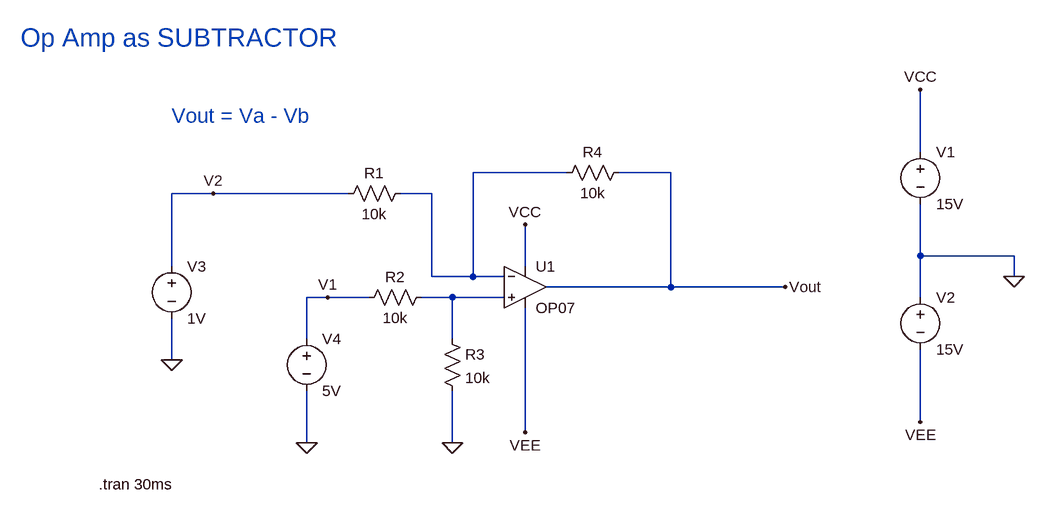
[diagram p0: schematic Op_Amp_Subtractor.asc]
Op_Amp_Subtractor.asc, the LTspice schematic file:
Version 4
SHEET 1 1220 680
WIRE 1056 -48 1056 -144
WIRE 512 -16 368 -16
WIRE 672 -16 592 -16
WIRE -32 16 -96 16
WIRE 176 16 -32 16
WIRE 304 16 256 16
WIRE 1056 112 1056 32
WIRE 1200 112 1056 112
WIRE -96 128 -96 16
WIRE 448 128 448 64
WIRE 304 144 304 16
WIRE 368 144 368 -16
WIRE 368 144 304 144
WIRE 416 144 368 144
WIRE 1200 144 1200 112
WIRE 672 160 672 -16
WIRE 672 160 480 160
WIRE 848 160 672 160
WIRE 144 176 112 176
WIRE 208 176 144 176
WIRE 336 176 288 176
WIRE 416 176 336 176
WIRE 1056 176 1056 112
WIRE 112 240 112 176
WIRE 336 240 336 176
WIRE -96 272 -96 208
WIRE 1056 368 1056 256
WIRE 448 384 448 192
WIRE 112 400 112 320
WIRE 336 400 336 320
FLAG 848 160 Vout
FLAG 112 400 0
FLAG -96 272 0
FLAG 1200 144 0
FLAG 1056 368 VEE
FLAG 1056 -144 VCC
FLAG 448 384 VEE
FLAG 448 64 VCC
FLAG -32 16 V2
FLAG 144 176 V1
FLAG 336 400 0
SYMBOL OpAmps\\OP07 448 96 R0
SYMATTR InstName U1
SYMBOL res 608 -32 R90
WINDOW 0 0 56 VBottom 2
WINDOW 3 32 56 VTop 2
SYMATTR InstName R4
SYMATTR Value 10k
SYMBOL res 272 0 R90
WINDOW 0 0 56 VBottom 2
WINDOW 3 32 56 VTop 2
SYMATTR InstName R1
SYMATTR Value 10k
SYMBOL res 304 160 R90
WINDOW 0 0 56 VBottom 2
WINDOW 3 32 56 VTop 2
SYMATTR InstName R2
SYMATTR Value 10k
SYMBOL voltage 112 224 R0
WINDOW 123 0 0 Left 0
WINDOW 39 0 0 Left 0
SYMATTR InstName V4
SYMATTR Value 5V
SYMBOL voltage 1056 -64 R0
WINDOW 123 0 0 Left 0
WINDOW 39 0 0 Left 0
SYMATTR InstName V1
SYMATTR Value 15V
SYMBOL voltage 1056 160 R0
WINDOW 123 0 0 Left 0
WINDOW 39 0 0 Left 0
SYMATTR InstName V2
SYMATTR Value 15V
SYMBOL res 320 224 R0
SYMATTR InstName R3
SYMATTR Value 10k
SYMBOL voltage -96 112 R0
WINDOW 123 0 0 Left 0
WINDOW 39 0 0 Left 0
SYMATTR InstName V3
SYMATTR Value 1V
TEXT -328 -224 Left 4 ;Op Amp as SUBTRACTOR
TEXT -208 464 Left 2 !.tran 30ms
TEXT -96 -104 Left 3 ;Vout = Va - Vb

The netlist it stands for:
* Op_Amp_Subtractor.asc
XU1 N002 N001 VCC VEE Vout LT1001  ; OP07, pins In+ In- V+ V- OUT
R4 Vout N001 10k
R1 N001 V2 10k
R2 N002 V1 10k
V4 V1 0 5V
V1 VCC 0 15V
V2 0 VEE 15V
R3 N002 0 10k
V3 V2 0 1V
* Op Amp as SUBTRACTOR
.tran 30ms
* Vout = Va - Vb
.lib LTC.lib
.backanno
.end